# EAGLE board ElectroLab R2 (EAGLE 9.4.2), part 1 of 2
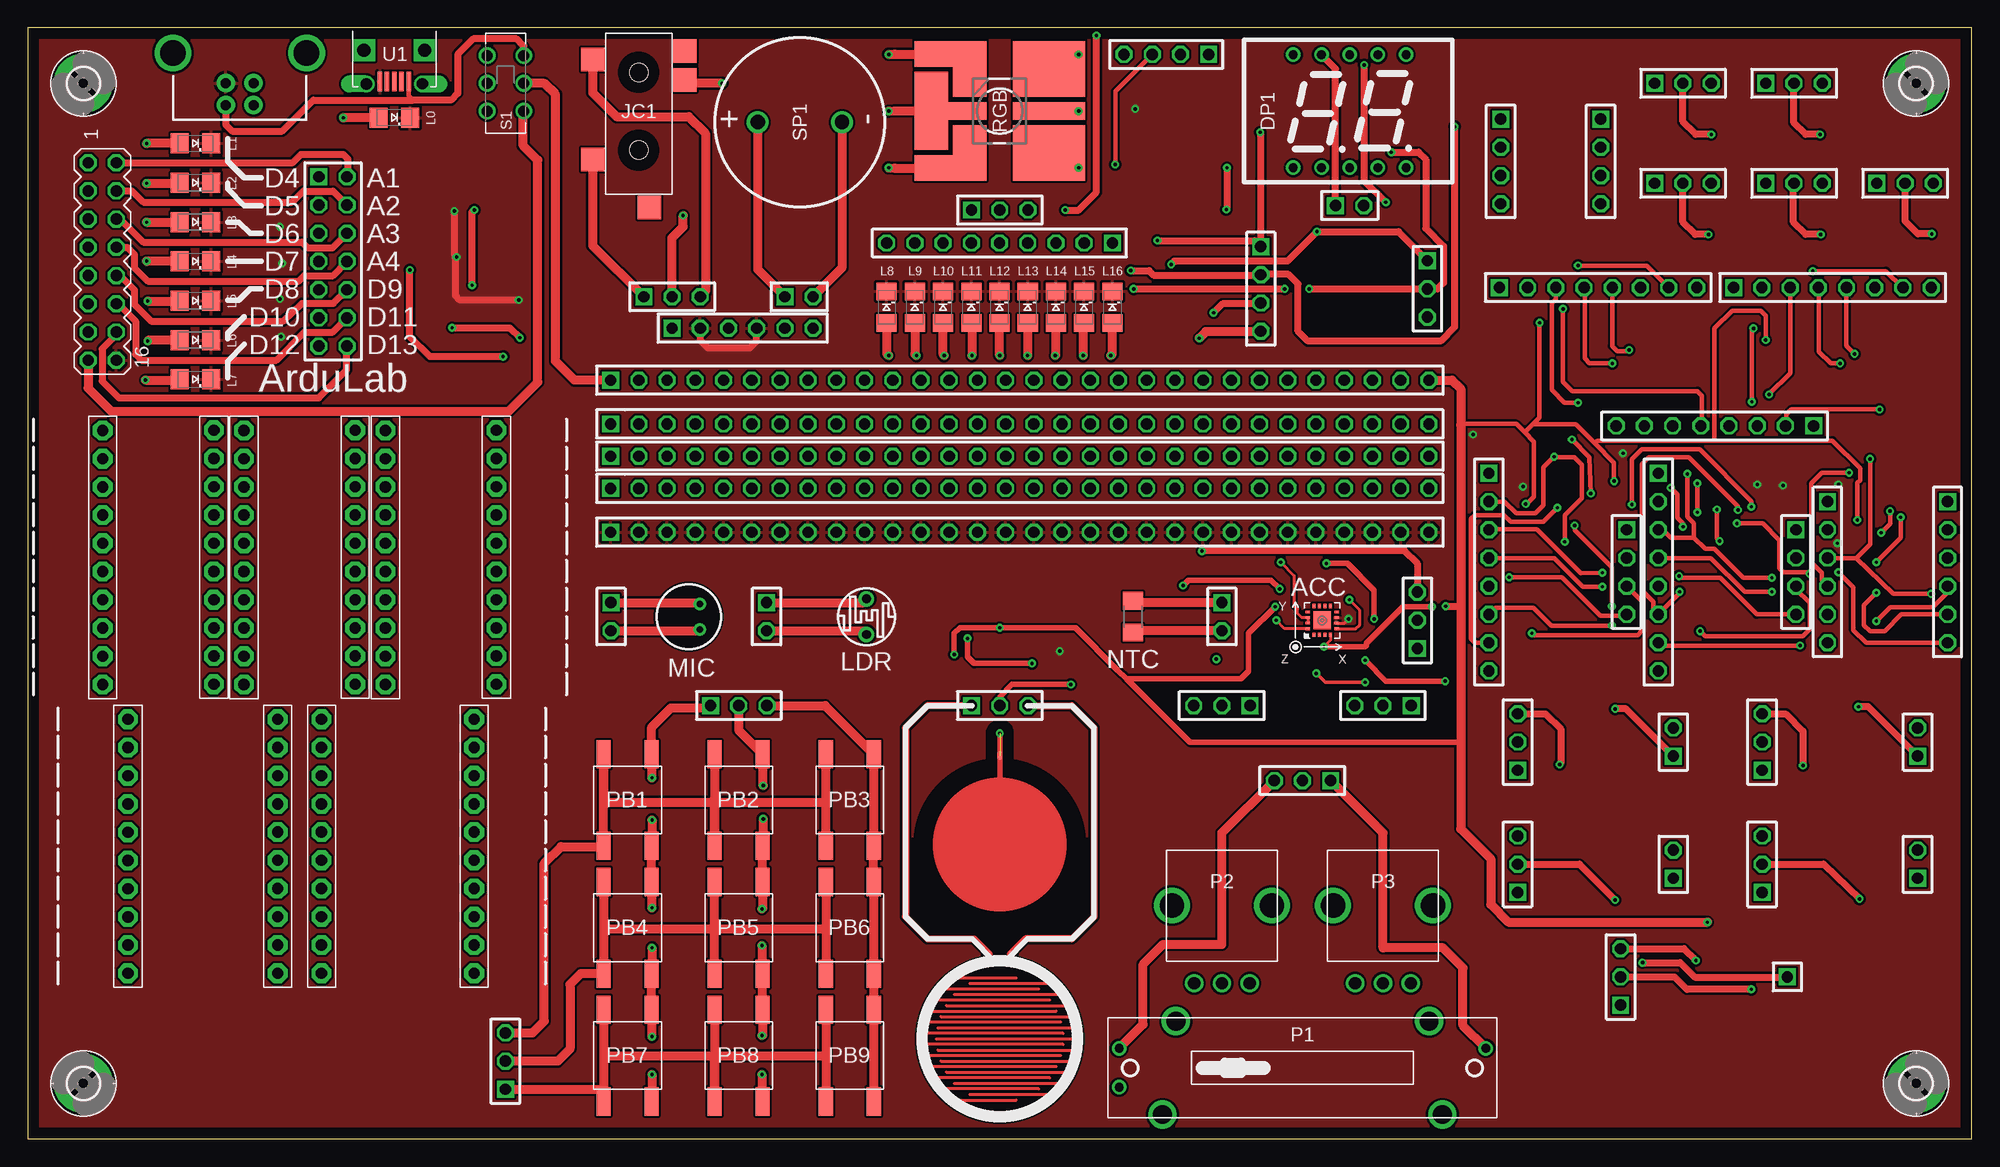
[diagram p4: board, top side]
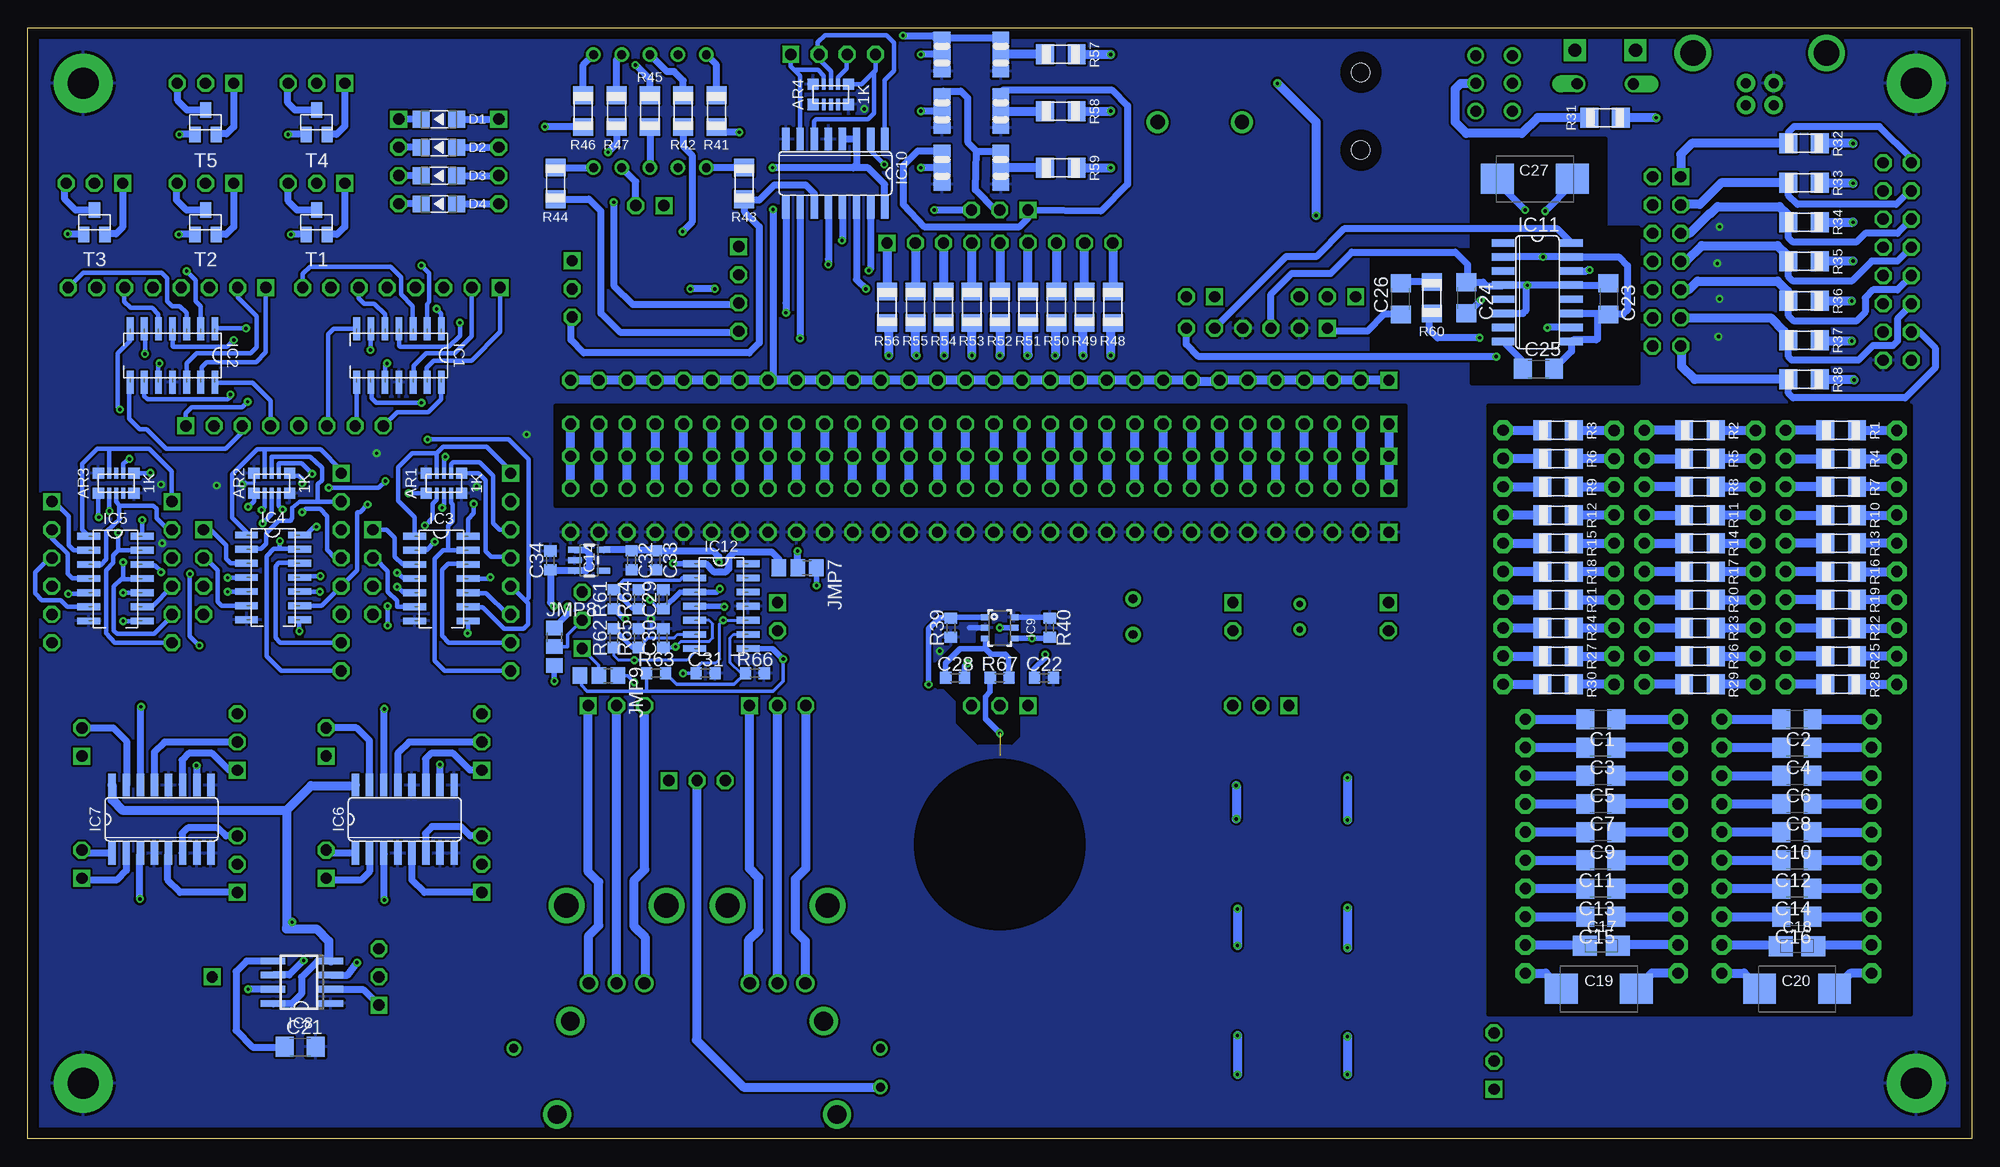
[diagram p5: board, bottom side, seen from below]

Size 175 x 100 mm. Coordinates in mm from the lower left corner, seen from the top.
Outline: 0,0 175,0 175,100 0,100 0,0
Copper layers (1*16): Top 0.035mm / dielectric 1.5mm / Bottom 0.035mm
Design rules "PCBWay": minimum track width 6mil, minimum drill 0.3mm, track to track 0.205mm, track to pad 0.205mm, pad to pad 0.205mm, via to via 0.205mm, smd to smd 8mil, copper to edge 40mil, drill to drill 8mil, minimum pad ring 10mil, minimum via ring 8mil, stop-mask expansion 4mil, vias tented up to drill 25mil, thermal gap 10mil
tRestrict: area 86.4,33.7 to 88.6,37.6
bRestrict: area 30,68 to 54,90; area 5.5,11.2 to 43.5,66; area 51,57 to 127.5,66; area 85.8,35.6 to 93.3,45.6

## Footprints (pad centres in the part's own frame; a part is rotated, then mirrored left to right if it is on the bottom)
RESISTOR_ARRAY_X8_CAY17 = smd 1 x 1: 1 -1.6,-0.9; 5 1.6,-0.9; 6 1.6,0.9; 10 -1.6,0.9 | smd 0.34 x 1: 2 -0.64,-0.9; 3 0,-0.9; 4 0.64,-0.9; 7 0.64,0.9; 8 0,0.9; 9 -0.64,0.9
C1206 = smd 1.6 x 1.8: 1 -1.4,0; 2 1.4,0
A/3216-18W = smd 2.15 x 1.8: + 1.475,0; - -1.475,0
D/7343-31W = smd 2.95 x 2.7: + 3.375,0; - -3.375,0
0603 = smd 1 x 1.1: 1 -0.86,0; 2 0.84,0
LED-1206 = smd 1.5 x 1.5: + -1.6,0; - 1.6,0
2X7_SEGMENT_COMMON_CATODE_12_PINS = drill 0.8: 1 -5.08,-5.08; 2 -2.54,-5.08; 3 0,-5.08; 4 2.54,-5.08; 5 5.08,-5.08; 6 5.08,5.08; 7 2.54,5.08; 8 0,5.08; 9 -2.54,5.08; 10 -5.08,5.08
2,8-PAD = drill 2.8 pad 5.334: B2,8 0,0
SOIC127P600X175-14N = smd 2.057 x 0.61: 1 -4.801,7.62; 2 -4.801,6.35; 3 -4.801,5.08; 4 -4.801,3.81; 5 -4.801,2.54; 6 -4.801,1.27; 7 -4.801,0; 8 0,0; 9 0,1.27; 10 0,2.54; 11 0,3.81; 12 0,5.08; 13 0,6.35; 14 0,7.62
SO16 = smd 0.66 x 2.032: 1 -4.445,-3.073; 2 -3.175,-3.073; 3 -1.905,-3.073; 4 -0.635,-3.073; 5 0.635,-3.073; 6 1.905,-3.073; 7 3.175,-3.073; 8 4.445,-3.073; 9 4.445,3.073; 10 3.175,3.073; 11 1.905,3.073; 12 0.635,3.073; 13 -0.635,3.073; 14 -1.905,3.073; 15 -3.175,3.073; 16 -4.445,3.073
SO08 = smd 0.6 x 2.2: 1 -1.905,-2.6; 2 -0.635,-2.6; 3 0.635,-2.6; 4 1.905,-2.6; 5 1.905,2.6; 6 0.635,2.6; 7 -0.635,2.6; 8 -1.905,2.6
SOT-23-6 = smd 0.51 x 0.8: 1 -0.95,-1.3; 2 0,-1.3; 3 0.95,-1.3; 4 0.95,1.3; 5 0,1.3; 6 -0.95,1.3
SN74LS247D = smd 0.66 x 2.032: A -0.635,3.073; B 0.635,3.073; BI/RBO -0.635,-3.073; C 1.905,3.073; D 3.175,3.073; E 4.445,3.073; F -3.175,3.073; G -1.905,3.073; GND 4.445,-3.073; IA 3.175,-3.073; IB -4.445,-3.073; IC -3.175,-3.073; ID 1.905,-3.073; LT -1.905,-3.073; RBI 0.635,-3.073; VCC -4.445,3.073
SOP-16 = smd 0.66 x 2.032: 1 -4.445,-3.073; 2 -3.175,-3.073; 3 -1.905,-3.073; 4 -0.635,-3.073; 5 0.635,-3.073; 6 1.905,-3.073; 7 3.175,-3.073; 8 4.445,-3.073; 9 4.445,3.073; 10 3.175,3.073; 11 1.905,3.073; 12 0.635,3.073; 13 -0.635,3.073; 14 -1.905,3.073; 15 -3.175,3.073; 16 -4.445,3.073
LFCSP-3X3 = smd 0.25 x 0.4: 1 -0.75,-1.3; 2 -0.25,-1.3; 3 0.25,-1.3; 4 0.75,-1.3; 9 0.75,1.3; 10 0.25,1.3; 11 -0.25,1.3; 12 -0.75,1.3 | smd 0.4 x 0.25: 5 1.3,-0.75; 6 1.3,-0.25; 7 1.3,0.25; 8 1.3,0.75; 13 -1.3,0.75; 14 -1.3,0.25; 15 -1.3,-0.25; 16 -1.3,-0.75 | smd 1.6 x 1.6: EXP 0,0
SOT23-5 = smd 0.55 x 1.2: 1 -0.95,-1.3; 2 0,-1.3; 3 0.95,-1.3; 4 0.95,1.3; 5 -0.95,1.3
4-JACK-SMD = smd 2.108 x 2.108: 1 2.362,-1.143; 2 4.216,7.137; 3 11.354,-1.143; 4 1.6,7.137; 5 15.672,3.962 | hole 1.651: 3.505,2.997; 10.516,2.997
A0R-JMP = smd 1.5 x 1.1: 1 0,1.5; 3 0,-1.5 | smd 1.5 x 1.3: 2 0,0
A0R-JMP' = smd 1.5 x 1.3: 1 0,1.7; 2 0,0; 3 0,-1.7
1206 = smd 1.6 x 1.803: A -1.422,0; C 1.422,0
TO-5_V10 = drill 0.8 pad 1.4: 1 -1.6,0; 2 1.6,0
WM-64PC/64PK = drill 0.6 pad 1: 1 -1,1.15; 2 -1,-1.15
R1206 = smd 1.6 x 1.803: 1 -1.422,0; 2 1.422,0
SLIDE_POT_20MM = drill 0.8: 1 -16.5,1.75; 2 -16.5,-1.75; 3 16.5,1.75 | drill 1.7: P$4 -12.6,-4.2; P$5 12.6,-4.2; P$6 -11.4,4.2; P$7 11.4,4.2
ALPS_RK09K_VERTICAL = drill 1.1: 1 -2.5,-7; 2 0,-7; 3 2.5,-7 | drill 2.2: P$1 -4.5,0; P$2 4.5,0
SW4-SMD-6.0X6.0X5.0MM = smd 2.54 x 1.27: 1 -4.129,2.159; 2 4.129,2.159; 3 -4.129,-2.159; 4 4.129,-2.159
1X01 = drill 1.016 square: 1 0,0
1X02 = drill 1.016 square: 1 -1.27,0 | drill 1.016 octagon: 2 1.27,0
1X03 = drill 1.016 square: 1 -2.54,0 | drill 1.016 octagon: 2 0,0; 3 2.54,0
1X04 = drill 1.016 square: 1 -3.81,0 | drill 1.016 octagon: 2 -1.27,0; 3 1.27,0; 4 3.81,0
1X06 = drill 1.016 square: 1 -6.35,0 | drill 1.016 octagon: 2 -3.81,0; 3 -1.27,0; 4 1.27,0; 5 3.81,0; 6 6.35,0
2X07 = drill 1.016 square: 1 -7.62,-1.27 | drill 1.016 octagon: 2 -7.62,1.27; 3 -5.08,-1.27; 4 -5.08,1.27; 5 -2.54,-1.27; 6 -2.54,1.27; 7 0,-1.27; 8 0,1.27; 9 2.54,-1.27; 10 2.54,1.27; 11 5.08,-1.27; 12 5.08,1.27; 13 7.62,-1.27; 14 7.62,1.27
1X08 = drill 1.016 square: 1 -8.89,0 | drill 1.016 octagon: 2 -6.35,0; 3 -3.81,0; 4 -1.27,0; 5 1.27,0; 6 3.81,0; 7 6.35,0; 8 8.89,0
1X09 = drill 1.016 square: 1 -10.16,0 | drill 1.016 octagon: 2 -7.62,0; 3 -5.08,0; 4 -2.54,0; 5 0,0; 6 2.54,0; 7 5.08,0; 8 7.62,0; 9 10.16,0
1X10-BIG = drill 1.016 pad 1.778 octagon: 1 -11.43,0; 2 -8.89,0; 3 -6.35,0; 4 -3.81,0; 5 -1.27,0; 6 1.27,0; 7 3.81,0; 8 6.35,0; 9 8.89,0; 10 11.43,0
1X30 = drill 1.016 square: 1 -36.83,0 | drill 1.016 octagon: 2 -34.29,0; 3 -31.75,0; 4 -29.21,0; 5 -26.67,0; 6 -24.13,0; 7 -21.59,0; 8 -19.05,0; 9 -16.51,0; 10 -13.97,0; 11 -11.43,0; 12 -8.89,0; 13 -6.35,0; 14 -3.81,0; 15 -1.27,0; 16 1.27,0; 17 3.81,0; 18 6.35,0; 19 8.89,0; 20 11.43,0; 21 13.97,0; 22 16.51,0; 23 19.05,0; 24 21.59,0; 25 24.13,0; 26 26.67,0; 27 29.21,0; 28 31.75,0; 29 34.29,0; 30 36.83,0
MA08-2 = drill 1.016 octagon: 1 -8.89,-1.27; 2 -8.89,1.27; 3 -6.35,-1.27; 4 -6.35,1.27; 5 -3.81,-1.27; 6 -3.81,1.27; 7 -1.27,-1.27; 8 -1.27,1.27; 9 1.27,-1.27; 10 1.27,1.27; 11 3.81,-1.27; 12 3.81,1.27; 13 6.35,-1.27; 14 6.35,1.27; 15 8.89,-1.27; 16 8.89,1.27
OVSTRGBBCR8 = smd 6.5 x 2.3: 1 4.442,-5.136; 5 4.442,5.136 | smd 6.5 x 5: 2 -4.442,-3.786; 6 -4.442,3.786 | smd 3 x 7: 3 6.15,-0.025 | smd 6.5 x 1.6: 4 -4.442,0 | smd 3 x 5: AEWSG 2.692,-3.786; SBE 2.692,3.786 | smd 5 x 1.6: SDF 3.692,0
DPDT_JS202011CQN = drill 1: 1 -2.5,-1.65; 2 0,-1.651; 3 2.5,-1.65; 4 -2.5,1.65; 5 0,1.651; 6 2.5,1.65
32MM_SPEAKER = drill 1.3: + 0,3.8; - 0,-3.8
SOT23-BEC = smd 1 x 1.4: B -0.95,-1.1; C 0,1.1; E 0.95,-1.1
SOT23-BCE = smd 1 x 1.4: B -0.95,-1.1; C 0.95,-1.1; E 0,1.1
FCI-10103594-0001LF = smd 0.4 x 1.75: 1 -1.3,4.525; 2 -0.65,4.525; 3 0,4.525; 4 0.65,4.525; 5 1.3,4.525 | drill 1 offset: P$1 -2.52,4.73; P$2 2.52,4.74 | drill 1.2 pad 2 square: P$3 -2.725,1.7; P$4 2.725,1.7
USB-B-PTH = drill 0.914 pad 1.676: D+ 0,1.25; D- 1.981,1.25; GND 0,-1.25; VBUS 1.981,-1.25 | drill 2.286: S1 -2.718,-6.02; S2 -2.718,6.02
CAPACITIVE_SENSOR_PAD = smd 0.406 x 0.813: 0 0,8
RESISTIVE_SENSOR_PAD = smd 0.305 x 0.61: 0 -0.95,7.65; 1 0.95,7.65

## Placement (x,y rotation side)
AR1  1K  [RESISTOR_ARRAY_X8_CAY17]  137.54,59.01 0 bottom
AR2  1K  [RESISTOR_ARRAY_X8_CAY17]  153.04,59.01 0 bottom
AR3  1K  [RESISTOR_ARRAY_X8_CAY17]  167.04,59.01 0 bottom
AR4  1K  [RESISTOR_ARRAY_X8_CAY17]  102.7,94 0 bottom
C1  10p  [C1206]  33.39,37.76 180 bottom
C2  10p  [C1206]  15.73,37.76 180 bottom
C3  100p  [C1206]  33.39,35.22 180 bottom
C4  100p  [C1206]  15.73,35.22 180 bottom
C5  1n  [C1206]  33.39,32.68 180 bottom
C6  1n  [C1206]  15.73,32.68 180 bottom
C7  10n  [C1206]  33.39,30.14 180 bottom
C8  10n  [C1206]  15.73,30.14 180 bottom
C9  47n  [C1206]  33.39,27.6 180 bottom
C10  47n  [C1206]  15.73,27.6 180 bottom
C11  100n  [C1206]  33.39,25.06 180 bottom
C12  100n  [C1206]  15.73,25.06 180 bottom
C13  1u  [C1206]  33.39,22.52 180 bottom
C14  1u  [C1206]  15.73,22.52 180 bottom
C15  10u  [C1206]  33.39,19.98 180 bottom
C16  10u  [C1206]  15.73,19.98 180 bottom
C17  100u  [A/3216-18W]  33.34,17.39 0 bottom
C18  100u  [A/3216-18W]  15.72,17.35 0 bottom
C19  1000u  [D/7343-31W]  33.58,13.5 0 bottom
C20  1000u  [D/7343-31W]  15.72,13.5 0 bottom
C21  10n  [C1206]  150.48,8.28 0 bottom
C22  100n  [0603]  83.5,41.5 0 bottom
C23  1u  [C1206]  32.7,75.6 270 bottom
C24  1u  [C1206]  45.5,75.7 270 bottom
C25  100n  [C1206]  39,69.3 0 bottom
C26  470n  [C1206]  51.4,75.6 90 bottom
C27  470u  [D/7343-31W]  39.33,86.4 180 bottom
C28  10nF  [0603]  91.5,41.5 0 bottom
C29  10nF  [0603]  117.79,48.58 90 bottom
C30  10nF  [0603]  117.79,45.09 90 bottom
C31  10nF  [0603]  113.98,41.91 0 bottom
C32  100nF  [0603]  120.65,52.07 270 bottom
C33  10uF  [0603]  118.43,52.07 270 bottom
C34  10uF  [0603]  127.95,52.07 90 bottom
D1  [LED-1206]  137.99,91.77 180 bottom
D2  [LED-1206]  137.99,89.23 180 bottom
D3  [LED-1206]  137.99,86.69 180 bottom
D4  [LED-1206]  137.99,84.15 180 bottom
DP1  2X7_SEGMENT_COMMON_CATODE_12_PINS  [2X7_SEGMENT_COMMON_CATODE_12_PINS]  119,92.5 0 top
H1  [2,8-PAD]  170,95 0 top
H2  [2,8-PAD]  170,5 0 top
H3  [2,8-PAD]  5,95 0 top
H4  [2,8-PAD]  5,5 90 top
IC1  LM2902DT  [SOIC127P600X175-14N]  145.39,68.1 270 bottom
IC2  LM2902DT  [SOIC127P600X175-14N]  165.78,68.1 270 bottom
IC3  SN74LV08ADR  [SOIC127P600X175-14N]  135.36,46.62 0 bottom
IC4  SN74LV32ADR  [SOIC127P600X175-14N]  150.51,46.72 0 bottom
IC5  SN74LV04ADR  [SOIC127P600X175-14N]  164.7,46.62 0 bottom
IC6  4027D  [SO16]  141.06,28.76 0 bottom
IC7  4027D  [SO16]  162.96,28.76 0 bottom
IC8  NE555D  [SO08]  150.33,14.1 90 bottom
IC9  AT42QT1012  [SOT-23-6]  87.5,46 270 bottom
IC10  CD4511BNSR  [SN74LS247D]  102.3,86.9 180 bottom
IC11  PAM8403  [SOP-16]  39.1,76.2 270 bottom
IC12  LM2902DT  [SOIC127P600X175-14N]  110.17,44.13 0 bottom
IC13  ADXL337  [LFCSP-3X3]  116.52,46.67 0 top
IC14  MIC5205  [SOT23-5]  124.46,52.07 270 bottom
JC1  [4-JACK-SMD]  52,99.5 270 top
JMP1  [A0R-JMP]  87.4,97.6 0 bottom
JMP2  [A0R-JMP]  87.4,92.5 0 bottom
JMP3  [A0R-JMP]  87.4,87.4 0 bottom
JMP4  [A0R-JMP]  92.7,97.6 0 bottom
JMP5  [A0R-JMP]  92.7,92.5 0 bottom
JMP6  [A0R-JMP]  92.7,87.4 0 bottom
JMP7  0R-JUMPA  [A0R-JMP']  105.7,51.4 270 bottom
JMP8  0R-JUMPA  [A0R-JMP']  127.6,44.3 0 bottom
JMP9  0R-JUMPA  [A0R-JMP']  123.6,41.7 270 bottom
L0  [1206]  33,91.92 0 top
L1  [1206]  15.09,89.59 0 top
L2  [1206]  15.09,86.05 0 top
L3  [1206]  15.09,82.51 0 top
L4  [1206]  15.09,78.97 0 top
L5  [1206]  15.09,75.43 0 top
L6  [1206]  15.09,71.89 0 top
L7  [1206]  15.09,68.35 0 top
L8  Grn  [1206]  77.32,74.85 90 top
L9  Grn  [1206]  79.86,74.85 90 top
L10  Grn  [1206]  82.4,74.85 90 top
L11  Ylw  [1206]  84.94,74.85 90 top
L12  Ylw  [1206]  87.48,74.85 90 top
L13  Ylw  [1206]  90.02,74.85 90 top
L14  Red  [1206]  92.56,74.85 90 top
L15  Red  [1206]  95.1,74.85 90 top
L16  Red  [1206]  97.64,74.85 90 top
LDR  [TO-5_V10]  75.5,47 270 top
MIC  [WM-64PC/64PK]  59.5,47 180 top
NTC  [R1206]  99.5,47 90 top
P1  [SLIDE_POT_20MM]  114.75,6.4 0 top
P2  [ALPS_RK09K_VERTICAL]  107.5,21 0 top
P3  [ALPS_RK09K_VERTICAL]  122,21 0 top
PB1  [SW4-SMD-6.0X6.0X5.0MM]  54,30.5 90 top
PB2  [SW4-SMD-6.0X6.0X5.0MM]  64,30.5 90 top
PB3  [SW4-SMD-6.0X6.0X5.0MM]  74,30.5 90 top
PB4  [SW4-SMD-6.0X6.0X5.0MM]  54,19 90 top
PB5  [SW4-SMD-6.0X6.0X5.0MM]  64,19 90 top
PB6  [SW4-SMD-6.0X6.0X5.0MM]  74,19 90 top
PB7  [SW4-SMD-6.0X6.0X5.0MM]  54,7.5 90 top
PB8  [SW4-SMD-6.0X6.0X5.0MM]  64,7.5 90 top
PB9  [SW4-SMD-6.0X6.0X5.0MM]  74,7.5 90 top
PH1  [1X01]  158.39,14.58 0 top
PH2  [1X02]  69.43,75.8 0 top
PH3  [1X02]  119,84 0 top
PH4  [1X02]  52.5,47 270 top
PH5  [1X02]  66.5,47 270 top
PH6  [1X02]  107.5,47 270 top
PH7  [1X02]  148.13,35.72 90 top
PH8  [1X02]  170.13,35.72 90 top
PH9  [1X02]  148.13,24.72 90 top
PH10  [1X02]  170.13,24.72 90 top
PH11  [1X03]  87.5,83.6 0 top
PH12  [1X03]  58,75.8 0 top
PH13  [1X03]  126,76.5 270 top
PH14  [1X03]  149,95 0 top
PH15  [1X03]  159,95 0 top
PH16  [1X03]  149,86 0 top
PH17  [1X03]  159,86 0 top
PH18  [1X03]  169,86 0 top
PH19  [1X03]  43,7 90 top
PH20  [1X03]  64,39 0 top
PH21  [1X03]  87.5,39 0 top
PH22  [1X03]  107.5,39 180 top
PH23  [1X03]  122,39 180 top
PH24  [1X03]  114.75,32.25 180 top
PH25  [1X03]  134.13,35.72 90 top
PH26  [1X03]  156.13,35.72 90 top
PH27  [1X03]  134.13,24.72 90 top
PH28  [1X03]  156.13,24.72 90 top
PH29  [1X03]  143.39,14.58 90 top
PH30  [1X03]  125.09,46.67 90 top
PH31  [1X04]  111,76.5 270 top
PH32  [1X04]  132.6,87.97 270 top
PH33  [1X04]  141.6,87.97 270 top
PH35  [1X04]  102.5,97.6 180 top
PH36  [1X04]  143.94,51.01 270 top
PH37  [1X04]  159.18,51.01 270 top
PH38  [1X06]  64.35,72.96 0 top
PH39  [1X06]  162.02,51.01 270 top
PH40  [1X06]  172.83,51.01 270 top
PH41  [2X07]  27.47,78.97 270 top
PH42  [1X08]  141.37,76.62 0 top
PH43  [1X08]  162.46,76.62 0 top
PH44  [1X08]  151.88,64.17 180 top
PH45  [1X08]  131.54,51.01 270 top
PH46  [1X08]  146.78,51.01 270 top
PH47  [1X09]  87.48,80.63 180 top
PH48  [1X10-BIG]  6.75,52.33 90 top
PH49  [1X10-BIG]  16.75,52.34 270 top
PH50  [1X10-BIG]  19.47,52.33 90 top
PH51  [1X10-BIG]  29.47,52.34 270 top
PH52  [1X10-BIG]  32.19,52.33 90 top
PH53  [1X10-BIG]  42.19,52.34 270 top
PH54  [1X10-BIG]  9.01,26.33 90 top
PH55  [1X10-BIG]  22.5,26.34 270 top
PH56  [1X10-BIG]  26.45,26.34 90 top
PH57  [1X10-BIG]  40.18,26.34 270 top
PH58  [1X30]  89.3,68.28 0 top
PH59  [1X30]  89.3,64.34 0 top
PH60  [1X30]  89.3,61.44 0 top
PH61  [1X30]  89.3,58.54 0 top
PH62  [1X30]  89.3,54.6 0 top
PH63  [MA08-2]  6.71,78.97 270 top
R1  100  [R1206]  11.75,63.76 180 bottom
R2  100  [R1206]  24.47,63.76 180 bottom
R3  100  [R1206]  37.24,63.76 180 bottom
R4  470  [R1206]  11.75,61.23 180 bottom
R5  470  [R1206]  24.47,61.22 180 bottom
R6  470  [R1206]  37.24,61.22 180 bottom
R7  1K  [R1206]  11.75,58.68 180 bottom
R8  1K  [R1206]  24.47,58.68 180 bottom
R9  1K  [R1206]  37.24,58.68 180 bottom
R10  4.7K  [R1206]  11.75,56.14 180 bottom
R11  4.7K  [R1206]  24.47,56.14 180 bottom
R12  4.7K  [R1206]  37.24,56.14 180 bottom
R13  10K  [R1206]  11.75,53.6 180 bottom
R14  10K  [R1206]  24.47,53.6 180 bottom
R15  10K  [R1206]  37.24,53.6 180 bottom
R16  10K  [R1206]  11.75,51.06 180 bottom
R17  10K  [R1206]  24.47,51.06 180 bottom
R18  10K  [R1206]  37.24,51.06 180 bottom
R19  15K  [R1206]  11.75,48.52 180 bottom
R20  15K  [R1206]  24.47,48.52 180 bottom
R21  15K  [R1206]  37.24,48.52 180 bottom
R22  47K  [R1206]  11.75,45.98 180 bottom
R23  47K  [R1206]  24.47,45.98 180 bottom
R24  47K  [R1206]  37.24,45.98 180 bottom
R25  100K  [R1206]  11.75,43.44 180 bottom
R26  100K  [R1206]  24.47,43.44 180 bottom
R27  100K  [R1206]  37.24,43.44 180 bottom
R28  470K  [R1206]  11.75,40.9 180 bottom
R29  470K  [R1206]  24.47,40.9 180 bottom
R30  470K  [R1206]  37.24,40.9 180 bottom
R31  470  [R1206]  33,91.92 0 bottom
R32  330  [R1206]  15.09,89.59 180 bottom
R33  330  [R1206]  15.09,86.05 180 bottom
R34  330  [R1206]  15.09,82.51 180 bottom
R35  330  [R1206]  15.09,78.97 180 bottom
R36  330  [R1206]  15.09,75.43 180 bottom
R37  330  [R1206]  15.09,71.89 180 bottom
R38  330  [R1206]  15.09,68.35 180 bottom
R39  100k  [0603]  91.9,46 90 bottom
R40  1M  [0603]  83,46 270 bottom
R41  330  [R1206]  113,92.5 90 bottom
R42  330  [R1206]  116,92.5 90 bottom
R43  330  [R1206]  110.5,86 90 bottom
R44  330  [R1206]  127.5,86 90 bottom
R45  330  [R1206]  119,92.5 270 bottom
R46  330  [R1206]  125,92.5 90 bottom
R47  330  [R1206]  122,92.5 90 bottom
R48  330  [R1206]  77.32,74.85 90 bottom
R49  330  [R1206]  79.86,74.85 90 bottom
R50  330  [R1206]  82.4,74.85 90 bottom
R51  330  [R1206]  84.94,74.85 90 bottom
R52  330  [R1206]  87.48,74.85 90 bottom
R53  330  [R1206]  90.02,74.85 90 bottom
R54  330  [R1206]  92.56,74.85 90 bottom
R55  330  [R1206]  95.1,74.85 90 bottom
R56  330  [R1206]  97.64,74.85 90 bottom
R57  150  [R1206]  82,97.6 180 bottom
R58  150  [R1206]  82,92.5 180 bottom
R59  220  [R1206]  82,87.4 180 bottom
R60  10k  [R1206]  48.6,75.7 90 bottom
R61  1k  [0603]  122.24,48.58 90 bottom
R62  1k  [0603]  122.24,45.09 90 bottom
R63  1k  [0603]  118.43,41.91 0 bottom
R64  2k  [0603]  120.02,48.58 90 bottom
R65  2k  [0603]  120.02,45.09 90 bottom
R66  2k  [0603]  109.54,41.91 0 bottom
R67  10k  [0603]  87.5,41.5 0 bottom
RGB  [OVSTRGBBCR8]  87.5,92.5 180 top
S1  [DPDT_JS202011CQN]  43,95 90 top
SP1  32MM_SPEAKER  [32MM_SPEAKER]  69.5,91.5 90 top
T1  [SOT23-BEC]  149,82.5 0 bottom
T2  [SOT23-BEC]  159,82.5 0 bottom
T3  [SOT23-BEC]  169,82.5 0 bottom
T4  [SOT23-BCE]  149,91.5 0 bottom
T5  [SOT23-BCE]  159,91.5 0 bottom
U1  USB  [FCI-10103594-0001LF]  33,99.68 180 top
U2  USB-B  [USB-B-PTH]  19.08,95.02 270 top
U$15  CAPACITIVE_SENSOR_PAD  [CAPACITIVE_SENSOR_PAD]  87.5,26.5 0 top
U$16  RESISTIVE_SENSOR_PAD  [RESISTIVE_SENSOR_PAD]  87.5,9 0 top